# Altium schematic sheet Flyback.SchDoc
size A4; SheetNumber: 1; SheetTotal: 1
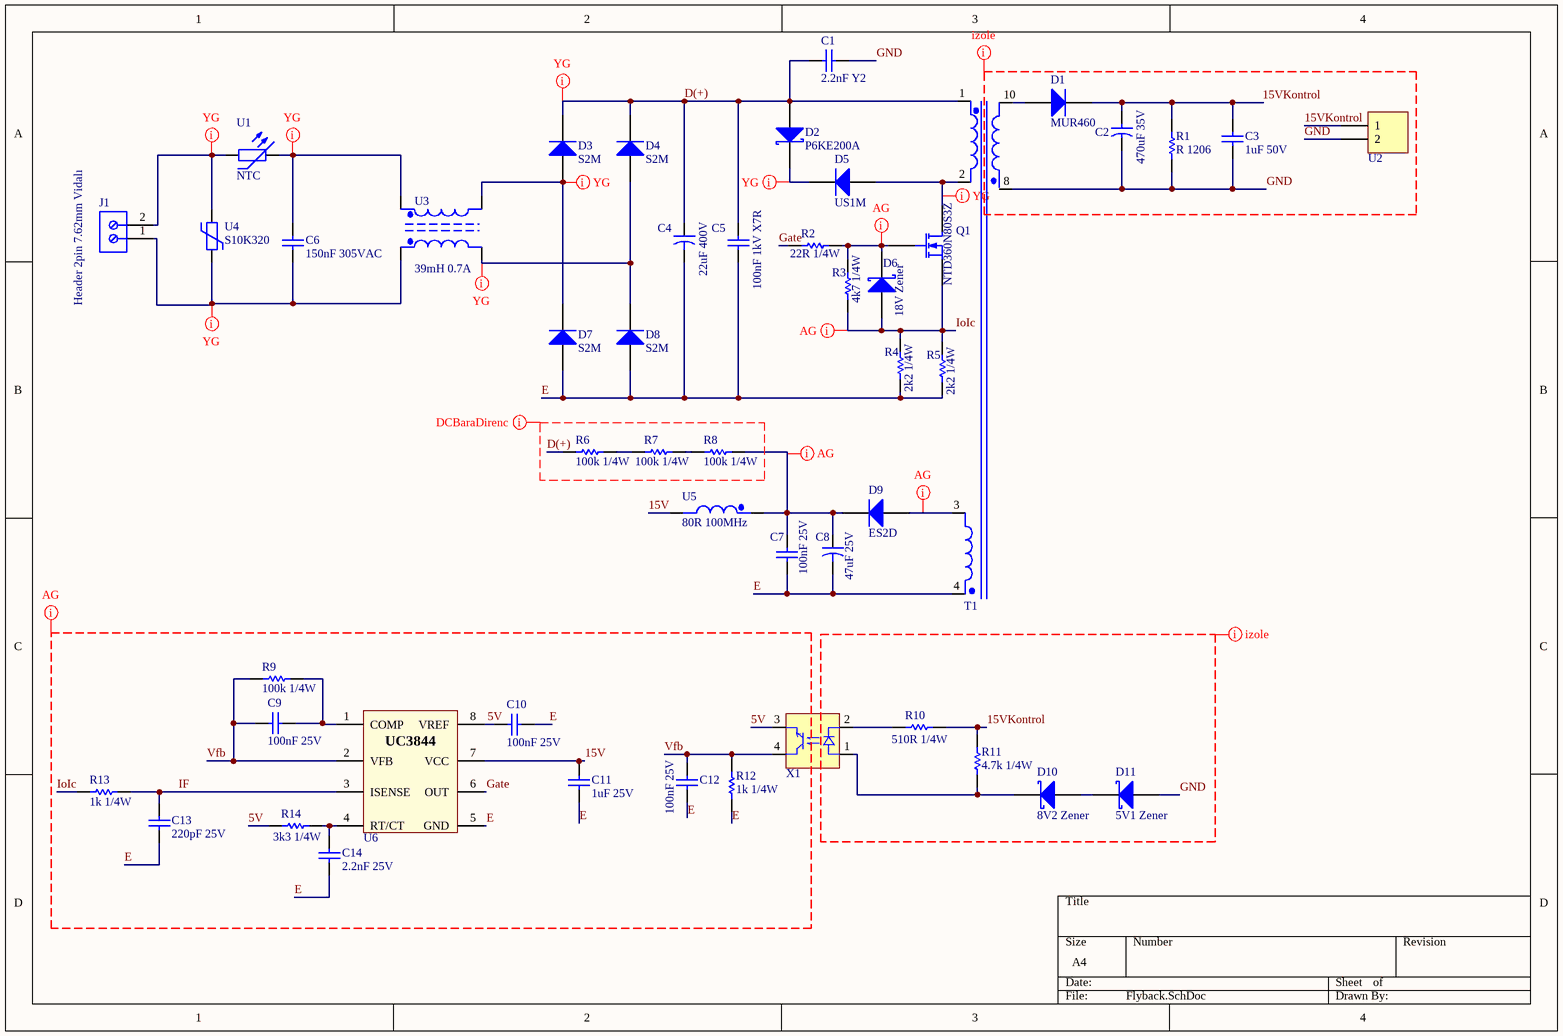
[diagram p0: Flyback.SchDoc]

## Parts
C1  2.2nF Y2  [4x13x9]
C2  470uF 35V  [CAPPRD500W60D1025H1750]
C3  1uF 50V  [1206]
C4  22uF 400V  [22uF 400V]
C5  100nF 1kV X7R  [RCE7U2J333J5B1H03B]
C6  150nF 305VAC  [CFR F15 L18 B6 H12]
C7  100nF 25V  [1206]
C8  47uF 25V  [CAPPRD200W50D525H1250]
C9  100nF 25V  [1206]
C10  100nF 25V  [1206]
C11  1uF 25V  [1206]
C12  100nF 25V  [1206]
C13  220pF 25V  [1206]
C14  2.2nF 25V  [1206]
D1  MUR460  [DO-201AD -Dik]
D2  P6KE200A  [DO-15((DO-204AC)]
D3  S2M  [DO-214AA(SMB)]
D4  S2M  [DO-214AA(SMB)]
D5  US1M  [DO-214AA(SMB)]
D6  18V Zener  [SOD-123]
D7  S2M  [DO-214AA(SMB)]
D8  S2M  [DO-214AA(SMB)]
D9  ES2D  [DO-214AA(SMB)]
D10  8V2 Zener  [SOD-123]
D11  5V1 Zener  [SOD-123]
J1  Header 2pin 7.62mm Vidalı  [Header 2 Pin 7.62mm Vidalı]
Q1  NTD360N80S3Z  [DPAK IGBT]
R1  R 1206  [RES_1206]
R2  22R 1/4W  [RES_1206]
R3  4k7 1/4W  [RES_1206]
R4  2k2 1/4W  [RES_1206]
R5  2k2 1/4W  [RES_1206]
R6  100k 1/4W  [RES_1206]
R7  100k 1/4W  [RES_1206]
R8  100k 1/4W  [RES_1206]
R9  100k 1/4W  [RES_1206]
R10  510R 1/4W  [RES_1206]
R11  4.7k 1/4W  [RES_1206]
R12  1k 1/4W  [RES_1206]
R13  1k 1/4W  [RES_1206]
R14  3k3 1/4W  [RES_1206]
T1  SMPS Tr  [SMPS Tr3]  (value not drawn)
U1  NTC  [NTC B57153S0100]
U2  Terminal Blok 2 Pin 2.54mm  [Header 2pin 2.54mm Vidalı]  (value not drawn)
U3  39mH 0.7A  [EMC SMPS TDK]
U4  S10K320  [Varistor630V]
U5  80R 100MHz  [1206 Bead]
U6  UC3844  [SOIC-OA8_L]  (value not drawn)
X1  PC81710NIP1B  [PC817 SMD]  (value not drawn)

## Nets
5V: C10.1 R14.1 U6.8(VREF) X1.3(E)
15V: C11.2 U5.2 U6.7(VCC)
15VKontrol: C2.1 C3.2 D1.2(K) R1.2 R10.1 R11.1 U2.1
D(+): C1.1 C4.1 C5.2 D2.1(A) D3.2(K) D4.2(K) R6.1 T1.1(Pri+)
E: C4.2 C5.1 C7.1 C8.2 C10.2 C11.1 C12.1 C13.2 C14.2 D7.1(A) D8.1(A) R4.1 R5.1 R12.1 T1.4(Sec3-) U6.5(GND)
Gate: R2.2 U6.6(OUT)
GND: C1.2 C2.2 C3.1 D11.1(A) R1.1 T1.8 U2.2
IF: C13.1 R13.2 U6.3(ISENSE)
IoIc: D6.1(A) Q1.3(S) R3.1 R4.2 R5.2 R13.1
Vfb: C9.2 C12.2 R9.1 R12.2 U6.2(VFB) X1.4(C)
NetC6_1: C6.1 J1.1 U3.1 U4.1
NetC6_2: C6.2 U1.2 U3.2
NetC7_2: C7.2 C8.1 D9.2(K) R8.2 U5.1
NetC9_1: C9.1 R9.2 U6.1(COMP)
NetC14_1: C14.1 R14.2 U6.4(RT/CT)
NetD1_1: D1.1(A) T1.10(Sec1+)
NetD2_2: D2.2(K) D5.2(K)
NetD3_1: D3.1(A) D7.2(K) U3.3
NetD4_1: D4.1(A) D8.2(K) U3.4
NetD5_1: D5.1(A) Q1.2(D) T1.2(Pri-)
NetD6_2: D6.2(K) Q1.1(G) R2.1 R3.2
NetD9_1: D9.1(A) T1.3(Sec3+)
NetD10_1: D10.1(A) D11.2(K)
NetD10_2: D10.2(K) R11.2 X1.1(A)
NetJ1_2: J1.2 U1.1 U4.2
NetR6_2: R6.2 R7.1
NetR7_2: R7.2 R8.1
NetR10_2: R10.2 X1.2(K)

## Layout directives
net class YG: D(+), IoIc, NetC6_1, NetC6_2, NetC7_2, NetD2_2, NetD3_1, NetD4_1, NetD5_1, NetD6_2, NetD9_1, NetJ1_2
net class izole: 15VKontrol, GND
net class DCBaraDirenc: D(+)
net class AG: 5V, 15V, E, Gate, IF, IoIc, Vfb

## Library data of the parts
C1 = Cap Y2 2.2nF 300V MKP TDK: 495-4967-1-ND; Designer: ZehraOzkan; Published: 8-Jun-2000; LatestRevisionDate: 17-Jul-2002; LatestRevisionNote: Re-released for DXP Platform.; PackageReference: RAD-0.3; Publisher: Altium Limited; PackageDescription: Radial Cap, Thru-Hole; 2 Leads; 0.3 in Pin Spacing
C2 = C 470uF 35V 1.76A 28mOhm: 860040475008; Designer: ZehraOzkan; Published: 8-Jun-2000; LatestRevisionDate: 17-Jul-2002; LatestRevisionNote: Re-released for DXP Platform.; PackageReference: RAD-0.3; Publisher: Altium Limited; PackageDescription: Radial Cap, Thru-Hole; 2 Leads; 0.3 in Pin Spacing
C3 C7 C9-C14 = C 1206: SMD 1206; Designer: ZehraOzkan; Deger: *
C4 = C 22uF 400V 270mArms: 400AX22MEFC12.5X16; Manufacturer_Name: AVX; Manufacturer_Part_Number: TPSE107K020R0150; Allied_Number: 70002020; Designer: ZehraOzkan; Datasheet Link: http://datasheets.avx.com/TPS.pdf; Height: 4.3mm; Mouser Part Number: 581-TPSE107K020R0150; Mouser Price/Stock: https://www.mouser.com/Search/Refine.aspx?Keyword=581-TPSE107K020R0150; RS Part Number: 1359911P; RS Price/Stock: http://uk.rs-online.com/web/p/products/1359911P; Allied Price/Stock: http://www.alliedelec.com/avx-tpse107k020r0150/70002020/
C5 = C Seramik 100nF 1kV X7R 5mm: 490-8944-ND; Designer: ZehraOzkan; Published: 8-Jun-2000; LatestRevisionDate: 17-Jul-2002; LatestRevisionNote: Re-released for DXP Platform.; PackageReference: RAD-0.3; Publisher: Altium Limited; PackageDescription: Radial Cap, Thru-Hole; 2 Leads; 0.3 in Pin Spacing
C6 = Cap 150nF 305VAC X2: 1572-1789-ND; Part Number: 890273322005CS; Insulation Resistance: 30000MOhm; Dissipation Factor@100kHz: 0.26%; Dissipation Factor@1kHz: 0.1%; Pitch: 7.5mm; Rated Voltage: 250VDC; Rate of Voltage Rise: 340V/us; Technical Reference: MPPP075154J250DCPP45004; Designer: ZehraOzkan; ComponentLink1Description: Manufacturer; ComponentLink1URL: http://www.we-online.de; ComponentLink2Description: Datasheet; ComponentLink2URL: https://katalog.we-online.com/pbs/datasheet/890273322005CS.pdf; Length: 10.5mm; Mounting Technology: THT; Packaging: Carton; Operating Temperature: -40 to +105degC; Width: 5mm; Capacitance: 150nF; Dissipation Factor@10kHz: 0.1%; Height: 11mm; Publisher: Wurth Elektronik; Published Date: August 2019
C8 = C 47uF 25V 250mArms 400mOhm: 1189-1590-1-ND; Designer: ZehraOzkan; ComponentLink1Description: http://www.rubycon.co.jp/en/catalog/e_pdfs/aluminum/e_px.pdf
D1 = Diyot DO-201AD Dik: MUR460RLGOSCT-ND; Designer: ZehraOzkan
D2 = TVS 200V DO-15: 497-13419-1-ND; Note: Pin 2 is not connected and not drawn.; Designer: ZehraOzkan; Published: 21-Mar-2003; LatestRevisionDate: 29-May-2009; LatestRevisionNote: IPC-7351 Footprint Added.; DatasheetVersion: Oct-1999; PackageVersion: Sep-2001; PackageReference: SOT-23; Publisher: Altium Limited; PackageDescription: 3-Pin SOT-23 Package 0.95 mm Pitch, 2.5 mm Lead Span; ComponentLink1Description: Manufacturer Link; ComponentLink1URL: http://www.infineon.com/; ComponentLink2Description: Datasheet; ComponentLink2URL: http://www.infineon.com/upload/Document/cmc_upload/documents/009/363/bat17series.pdf
D3 D4 D7 D8 = D 1N4007 DO-214AA(SMB): 1655-1N4007FLCT-ND; Designer: ZehraOzkan
D5 = US1M: SMA; Designer: ZehraOzkan
D6 D10 D11 = Zener SOD-123_1: SOD-123; Note: Pin 2 is not connected and not drawn.; Designer: ZehraOzkan; Published: 21-Mar-2003; LatestRevisionDate: 29-May-2009; LatestRevisionNote: IPC-7351 Footprint Added.; DatasheetVersion: Oct-1999; PackageVersion: Sep-2001; PackageReference: SOT-23; Publisher: Altium Limited; PackageDescription: 3-Pin SOT-23 Package 0.95 mm Pitch, 2.5 mm Lead Span; ComponentLink1Description: Manufacturer Link; ComponentLink1URL: http://www.infineon.com/; ComponentLink2Description: Datasheet; ComponentLink2URL: http://www.infineon.com/upload/Document/cmc_upload/documents/009/363/bat17series.pdf
D9 = D ES2D: ES2DFSCT-ND; Designer: ZehraOzkan
J1 = Header 2pin 7.62mm Vidalı: 691214410002; Part Number: 691218410002; Compliance: Lead free / RoHS; Modularity: Yes; PCB/Cable/Panel: PCB; Pin Number: 2; Rated Current [UL]: 30A; Working Voltage [UL]: 300VAC; Designer: ZehraOzkan; ComponentLink1Description: Manufacturer; ComponentLink1URL: http://www.we-online.de; ComponentLink2URL: https://katalog.we-online.de/em/datasheet/691218410002.pdf; ComponentLink2Description: Datasheet; Mounting Technology: THT; Packaging: Box; Operating Temperature: -40 to +105degC; Pitch: 7.62mm; Published Date: October 2019; Type: Horizontal; Publisher: Wurth Elektronik; Application: Rising Cage Clamp
Q1 = MOSFET DPAK: DPAK; Designer: ZehraOzkan; Published: 8-Jun-2000; LatestRevisionDate: 17-Jul-2002; LatestRevisionNote: Re-released for DXP Platform.; PackageVersion: 1995/1996; PackageReference: E3; Publisher: Altium Limited; PackageDescription: TO, Flat Index; 3 In-Line, Axial Leads; Body Dia. 4.6mm; Lead Dia. 0.5 mm (max)
R1-R14 = R 1206: SMD 1206; Designer: ZehraOzkan; Deger: *
T1 = SMPS Tr EF25: Sim Note: Enter the turns ratios, Core loss resistance, Magnetising Reactance, Leakage Reactances and Resistances referred to the primary side into the parameter fields.; Designer: ZehraOzkan; Published: 25-Jan-2001; LatestRevisionDate: 17-Jul-2002; LatestRevisionNote: Re-released for DXP Platform.; PackageReference: TRF_8; Publisher: Altium Limited; PackageDescription: Transformer; 8 Leads
U1 = NTC 10R 2A 8.5mm: 495-2076-ND; Designer: ZehraOzkan; Published: 8-Jun-2000; LatestRevisionDate: 17-Jul-2002; LatestRevisionNote: Re-released for DXP Platform.; PackageReference: AXIAL-0.4; Publisher: Altium Limited; PackageDescription: Axial Device, Thru-Hole; 2 Leads; 0.4 in Pin Spacing
U2 = Header 2 Pin 2.54mm Vidalı: 691210910002; Designer: ZehraOzkan; LatestRevisionDate: 17-Jul-2002; LatestRevisionNote: Re-released for DXP Platform.; Publisher: Altium Limited
U3 = EMC SMPS TDK 39mH 0.7A: 495-2781-ND; Designer: ZehraOzkan
U4 = Varistor S10K320: Designer: ZehraOzkan; Published: 8-Jun-2000; LatestRevisionDate: 17-Jul-2002; LatestRevisionNote: Re-released for DXP Platform.; PackageReference: AXIAL-0.4; Publisher: Altium Limited; PackageDescription: Axial Device, Thru-Hole; 2 Leads; 0.4 in Pin Spacing
U5 = Bead 1206: SMD 1206; Designer: ZehraOzkan
U6 = UC3844: SOIC8; Designer: ZehraOzkan; PackageReference: SOIC-OA8
X1 = PC817: 1855-1014-1-ND; Designer: ZehraOzkan